# Altium project NANOEveryV3.0.PrjPcb
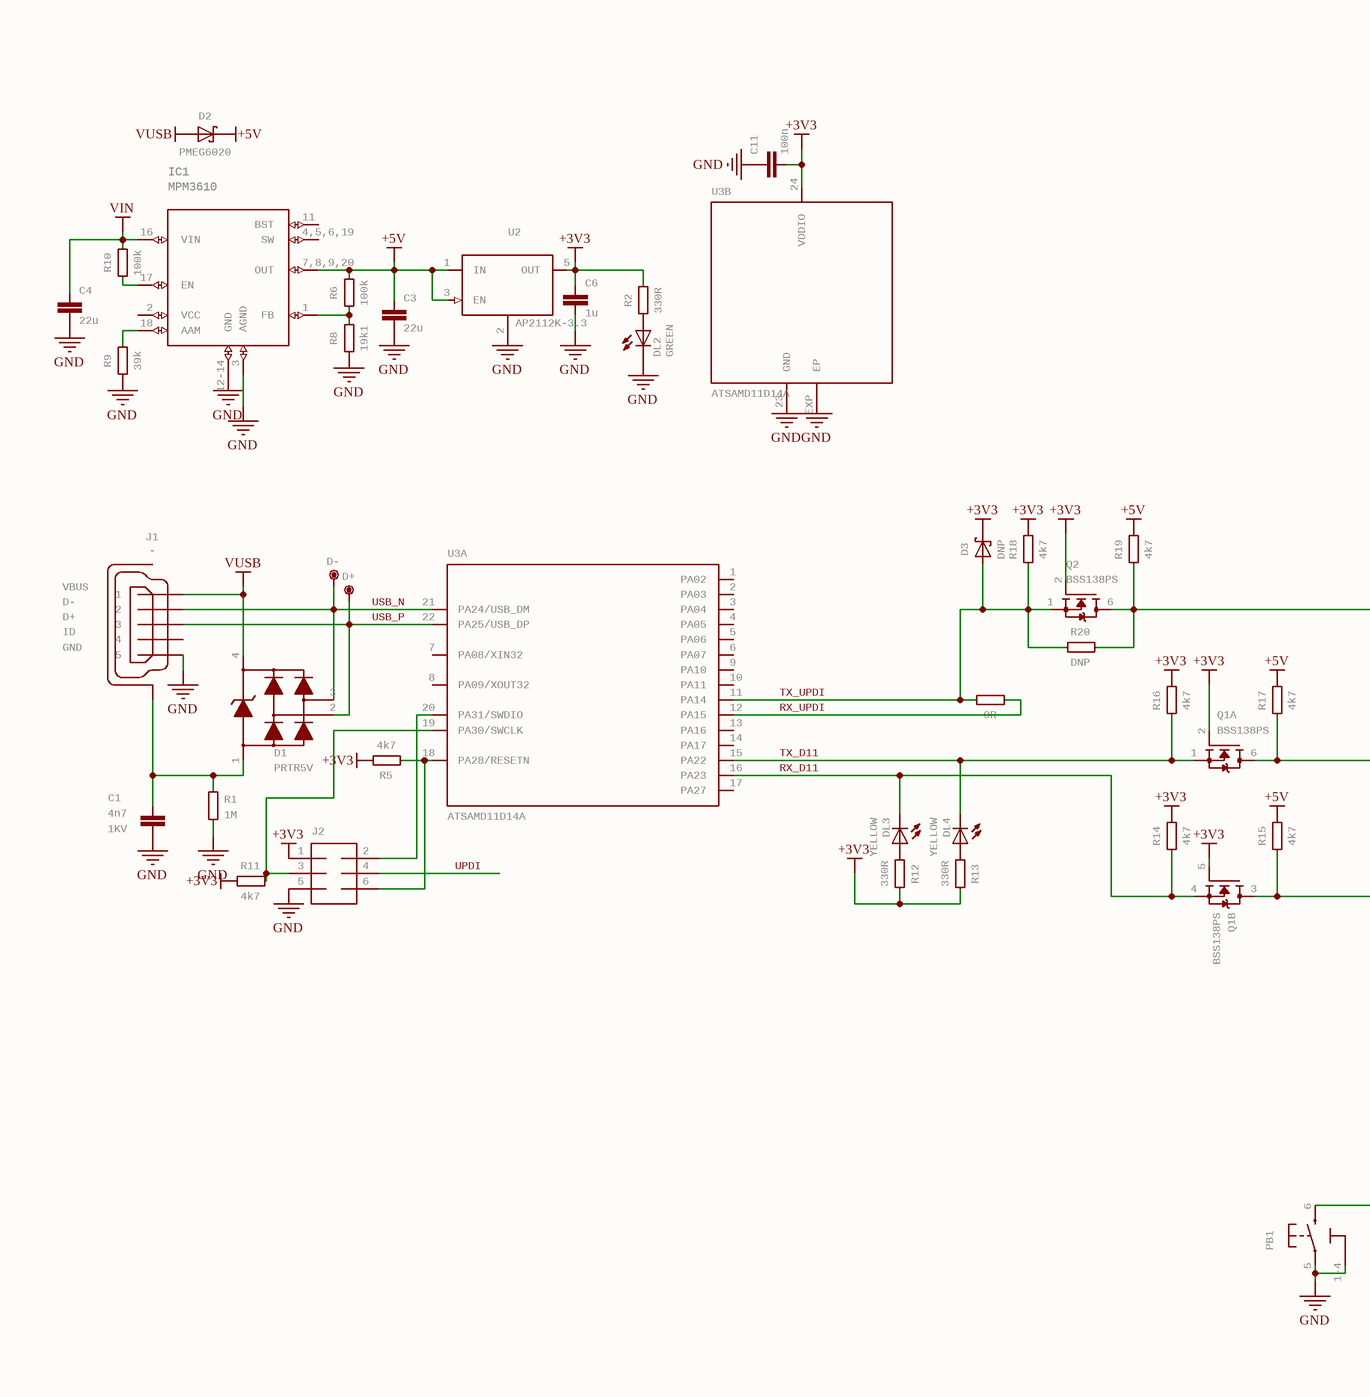
[diagram p0: NANOEveryV3.0.SchDoc, left]
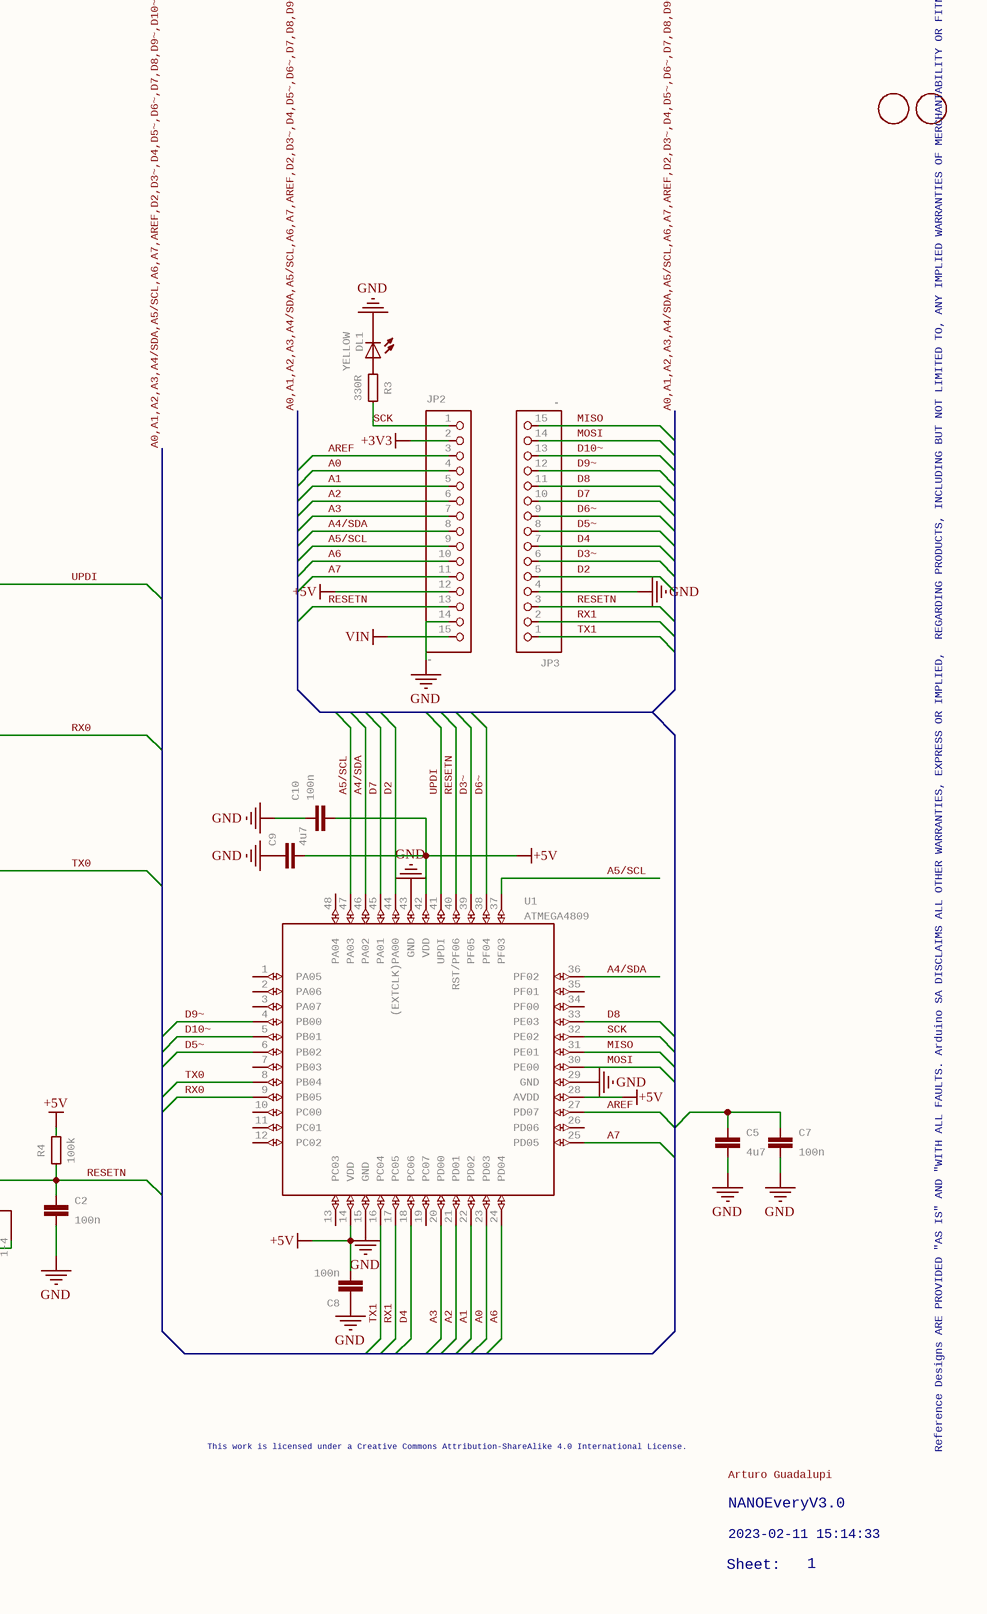
[diagram p1: NANOEveryV3.0.SchDoc, right]
1 sheet, 53 parts. Net scope: global (net labels, ports and power ports of the same name join across sheets).
Board file: NANOEveryV3.0.PcbDoc

## Sheet NANOEveryV3.0.SchDoc: NANOEveryV3.0
size 411 x 291 mm; Origin: Eagle; Date: 2023-02-11 15:14:33; SheetNumber: 1; CODE-ARDUINO: DNP; DATASHEET: DNP; DISTRIBUTOR-LINK: DNP; DISTRIBUTOR-PN: DNP; MANUFACTURER: DNP; MANUFACTURER-PN: DNP; NOTE: DNP; Value: DNP; GateName_1: G$1; SymbolName_1: A3L-LOC; LibraryName: Arduino-utility; DeviceSetName: A3-FRAME; Sheet: Sheet:; ReferenceDesignsAREPROVIDED"ASIS"AND"WITHALLFAULTS.ArduinoSADISCLAIMSALLOTHERWARRANTIES,EXPRESSORIMPLIED,
REGARDINGPRODUCTS,INCLUDINGBUTNOTLIMITEDTO,ANYIMPLIEDWARRANTIESOFMERCHANTABILITYORFITNESSFORAPARTICULARPURPOSE

ArduinoSAmaymakechangestospecificationsandproductdescriptionsatanytime,withoutnotice.TheCustomermustnot
relyontheabsenceorcharacteristicsofanyfeaturesorinstructionsmarked"reserved"or"undefined."ArduinoSAreserves
theseforfuturedefinitionandshallhavenoresponsibilitywhatsoeverforconflictsorincompatibilitiesarisingfromfuturechangestothem.
TheproductinformationontheWebSiteorMaterialsissubjecttochangewithoutnotice.Donotfinalizeadesignwiththisinfo

ARDUINOandotherArduinobrandsandlogosandTrademarksofArduinoSA.AllArduinoSATrademarkscannotbeusedwithoutowner'sformalpermission: Reference Designs ARE PROVIDED "AS IS" AND "WITH ALL FAULTS. Arduino SA DISCLAIMS ALL OTHER WARRANTIES, EXPRESS OR IMPLIED, / REGARDING PRODUCTS, INCLUDING BUT NOT LIMITED TO, ANY IMPLIED WARRANTIES OF MERCHANTABILITY OR FITNESS FOR A PARTICULAR PURPOSE / Arduino SA may make changes to specifications and product descriptions at any time, without notice. The Customer must not / rely on the absence or characteristics of any features or instructions marked "reserved" or "undefined." Arduino SA reserves / these for future definition and shall have no responsibility whatsoever for conflicts or incompatibilities arising from future changes to them. / The product information on the Web Site or Materials is subject to change without notice. Do not finalize a design with this info / ARDUINO and other Arduino brands and logos and Trademarks of Arduino SA. All Arduino SA Trademarks cannot be used without owner's formal permission; ThisworkislicensedunderaCreativeCommonsAttribution-ShareAlike4.0InternationalLicense.: This work is licensed under a Creative Commons Attribution-ShareAlike 4.0 International License.

### Parts
C1  4n7  VOLTAGE: 1KV  [0805-R2013X50N]
C2  100n  [0402-1005X55N]
C3  22u  [0805-R2013X50N]
C4  22u  [0805-R2013X50N]
C5  4u7  [0402-1005X55N]
C6  1u  [0402-1005X55N]
C7  100n  [0402-1005X55N]
C8  100n  [0402-1005X55N]
C9  4u7  [0402-1005X55N]
C10  100n  [0402-1005X55N]
C11  100n  [0402-1005X55N]
D1  PRTR5V  [SOT190P230X110-4N]
D2  PMEG6020  [SODFL3517X110N]
D3  DNP  [SODFL3517X110N]
D+  DNP  [TP-1.00MM]  (value not drawn)
D-  DNP  [TP-1.00MM]  (value not drawn)
DL1  YELLOW  [LEDC1608X80N-AK]
DL2  GREEN  [LEDC1608X80N-AK]
DL3  YELLOW  [LEDC1608X80N-AK]
DL4  YELLOW  [LEDC1608X80N-AK]
FD1  DNP  [FD-1-1.5]  (value not drawn)
FD2  DNP  [FD-1-1.5]  (value not drawn)
IC1  MPM3610  [MPM3610]
J1  -  [ZX62-AB-5PA]
J2  DNP  [2X03-TP]  (value not drawn)
JP2  -  [1X15-CASTELL]
JP3  -  [1X15-CASTELL]
PB1  PTS820  [C&K_PTS820_NO_HOLES]  (value not drawn)
Q1  BSS138PS  [SOT363]  (parts A,B of 2)
Q2  BSS138PS  [SOT363]
R1  1M  [0402-1005X55N]
R2  330R  [0402-1005X55N]
R3  330R  [0402-1005X55N]
R4  100k  [0402-1005X55N]
R5  4k7  [0402-1005X55N]
R6  100k  [0402-1005X55N]
R7  0R  [0402-1005X55N]
R8  19k1  [0402-1005X55N]
R9  39k  [0402-1005X55N]
R10  100k  [0402-1005X55N]
R11  4k7  [0402-1005X55N]
R12  330R  [0402-1005X55N]
R13  330R  [0402-1005X55N]
R14  4k7  [0402-1005X55N]
R15  4k7  [0402-1005X55N]
R16  4k7  [0402-1005X55N]
R17  4k7  [0402-1005X55N]
R18  4k7  [0402-1005X55N]
R19  4k7  [0402-1005X55N]
R20  DNP  [0402-1005X55N]
U1  ATMEGA4809  [TQFP48]
U2  AP2112K-3.3  [SOT25]
U3  ATSAMD11D14A  [HVQFN24]  (parts A,B of 2)

### Nets
+3V3: C6.1 C11.2 D3.C J2.1 JP2.2 Q1.2(G) Q1.5(G) Q2.2(G) R2.2 R5.2 R11.1 R12.2 R13.2 R14.2 R16.2 R18.2 U2.5(OUT) U3.24(VDDIO)
+5V: C3.1 C8.2 C9.2 C10.2 D2.C IC1.7,8,9,20(OUT) JP2.12 R4.2 R6.2 R15.2 R17.2 R19.2 U1.14(VDD) U1.28(AVDD) U1.42(VDD) U2.1(IN) U2.3(EN)
GND: C1.2 C2.2 C3.2 C4.2 C5.2 C6.2 C7.2 C8.1 C9.1 C10.1 C11.1 DL1.C DL2.C IC1.3(AGND) IC1.12-14(GND) J1.5 J2.5 JP2.14 JP3.4 PB1.1-4 PB1.5 R1.1 R8.1 R9.1 U1.15(GND) U1.29(GND) U1.43(GND) U2.2(GND/ADJ) U3.23(GND) U3.EXP(EP)
VIN: C4.1 IC1.16(VIN) JP2.15 R10.2
VUSB: D1.4 D2.A J1.1
A0: JP2.4 U1.23(PD03)
A1: JP2.5 U1.22(PD02)
A2: JP2.6 U1.21(PD01)
A3: JP2.7 U1.20(PD00)
A4/SDA: JP2.8 U1.36(PF02) U1.46(PA02)
A5/SCL: JP2.9 U1.37(PF03) U1.47(PA03)
A6: JP2.10 U1.24(PD04)
A7: JP2.11 U1.25(PD05)
AREF: C5.1 C7.1 JP2.3 U1.27(PD07)
D2: JP3.5 U1.44((EXTCLK)PA00)
D3~: JP3.6 U1.39(PF05)
D4: JP3.7 U1.18(PC06)
D5~: JP3.8 U1.6(PB02)
D6~: JP3.9 U1.38(PF04)
D7: JP3.10 U1.45(PA01)
D8: JP3.11 U1.33(PE03)
D9~: JP3.12 U1.4(PB00)
D10~: JP3.13 U1.5(PB01)
MISO: JP3.15 U1.31(PE01)
MOSI: JP3.14 U1.30(PE00)
RESETN: C2.1 JP2.13 JP3.3 PB1.6 R4.1 U1.40(RST/PF06)
RX0: Q1.6(D) R17.1 U1.9(PB05)
RX1: JP3.2 U1.17(PC05)
RX_D11: DL3.C Q1.4(S) R14.1 U3.16(PA23)
RX_UPDI: R7.2 U3.12(PA15)
SCK: JP2.1 R3.2 U1.32(PE02)
TX0: Q1.3(D) R15.1 U1.8(PB04)
TX1: JP3.1 U1.16(PC04)
TX_D11: DL4.C Q1.1(S) R16.1 U3.15(PA22)
TX_UPDI: D3.A Q2.1(S) R7.1 R18.1 R20.1 U3.11(PA14)
UPDI: J2.4 Q2.6(D) R19.1 R20.2 U1.41(UPDI)
USB_N: D1.3 D-.X(P$1) J1.2 U3.21(PA24/USB_DM)
USB_P: D1.2 D+.X(P$1) J1.3 U3.22(PA25/USB_DP)
NetC1_1: C1.1 D1.1 J1.6-11(SH) R1.2
NetDL1_A: DL1.A R3.1
NetDL2_A: DL2.A R2.1
NetDL3_A: DL3.A R12.1
NetDL4_A: DL4.A R13.1
NetIC1_1: IC1.1(FB) R6.1 R8.2
NetIC1_17: IC1.17(EN) R10.1
NetIC1_18: IC1.18(AAM) R9.2
NetJ2_2: J2.2 U3.20(PA31/SWDIO)
NetJ2_3: J2.3 R11.2 U3.19(PA30/SWCLK)
NetJ2_6: J2.6 R5.1 U3.18(PA28/RESETN)

Not connected (* = marked no-connect by the designer): IC1 2(VCC) 4,5,6,19(SW) 11(BST); J1 4; U1 1(PA05) 2(PA06) 3(PA07) 7(PB03) 10(PC00) 11(PC01) 12(PC02) 13(PC03) 19(PC07) 26(PD06) 34(PF00) 35(PF01) 48(PA04); U3 1(PA02) 2(PA03) 3(PA04) 4(PA05) 5(PA06) 6(PA07) 7(PA08/XIN32) 8(PA09/XOUT32) 9(PA10) 10(PA11) 13(PA16) 14(PA17) 17(PA27)

### Buses and harness runs
bus A0,A1,A2,A3,A4/SDA,A5/SCL,A6,A7,AREF,D2,D3~,D4,D5~,D6~,D7,D8,D9~,D10~,MISO,MOSI,RESETN,RX0,RX1,SCK,TX1,UPDI,VIN

### Notes on the sheet
- This work is licensed under a Creative Commons Attribution-ShareAlike 4.0 International License.
- (near FD2) Reference Designs ARE PROVIDED "AS IS" AND "WITH ALL FAULTS. Arduino SA DISCLAIMS ALL OTHER WARRANTIES, EXPRESS OR IMPLIED,
  REGARDING PRODUCTS, INCLUDING BUT NOT LIMITED TO, ANY IMPLIED WARRANTIES OF MERCHANTABILITY OR FITNESS FOR A PARTICULAR PURPOSE
  Arduino SA may make changes to specifications and product descriptions at any time, without notice. The Customer must not
  rely on the absence or characteristics of any features or instructions marked "reserved" or "undefined." Arduino SA reserves
  these for future definition and shall have no responsibility whatsoever for conflicts or incompatibilities arising from future changes to them.
  The product information on the Web Site or Materials is subject to change without notice. Do not finalize a design with this info
  ARDUINO and other Arduino brands and logos and Trademarks of Arduino SA. All Arduino SA Trademarks cannot be used without owner's formal permission
- Arturo Guadalupi
- NANOEveryV3.0
- Sheet:
- 2023-02-11 15:14:33
- 1

### Library data of the parts
C1 = C-0805: SMD Capacitor; MANUFACTURER: Kemet; MANUFACTURER-PN: C0805C472KDRACTU; GateName_1: G$1; SymbolName_1: C; DeviceName: -0805; CODE-ARDUINO: 0689; LibraryName: Arduino-rcl; DeviceSetName: C; DATASHEET: http://www.kemet.com/Lists/ProductCatalog/Attachments/40/KEM_C1010_X7R_HV_SMD.pdf; DISTRIBUTOR-LINK: www.kemet.com/docfinder?Partnumber=C0805C472KDRACTU; DISTRIBUTOR-PN: 399-6738-1-ND; NOTE: -
C2 C7 C8 C10 C11 = C-0402: SMD Capacitor; MANUFACTURER: TDK; MANUFACTURER-PN: C1005X5R1H104K050BB; GateName_1: G$1; SymbolName_1: C; DeviceName: -0402; CODE-ARDUINO: 0132; LibraryName: Arduino-rcl; DeviceSetName: C; DATASHEET: http://www.tdk.com/pdf/TDKMLCCCapRange.pdf; DISTRIBUTOR-LINK: http://www.digikey.com/product-detail/en/tdk-corporation/C1005X5R1H104K050BB/445-5942-1-ND/2443982; DISTRIBUTOR-PN: 445-5942-1-ND; NOTE: -
C3 C4 = C-0805: SMD Capacitor; MANUFACTURER: Samsung; MANUFACTURER-PN: CL21A226MQCLQNC; GateName_1: G$1; SymbolName_1: C; DeviceName: -0805; CODE-ARDUINO: 2233; LibraryName: Arduino-rcl; DeviceSetName: C; DATASHEET: https://media.digikey.com/pdf/Data%20Sheets/Samsung%20PDFs/CL21A226MQCLQNC_character.pdf; DISTRIBUTOR-LINK: https://www.digikey.com/product-detail/en/samsung-electro-mechanics-america-inc/CL21A226MQCLQNC/1276-2412-1-ND/3890498; DISTRIBUTOR-PN: 1276-2412-1-ND; NOTE: -
C5 C9 = C-0402: SMD Capacitor; MANUFACTURER: Murata; MANUFACTURER-PN: GRM155R60J475ME47D; GateName_1: G$1; SymbolName_1: C; DeviceName: -0402; CODE-ARDUINO: 0833; LibraryName: Arduino-rcl; DeviceSetName: C; DATASHEET: http://search.murata.co.jp/Ceramy/image/img/A01X/partnumbering_e_01.pdf; DISTRIBUTOR-LINK: http://www.digikey.com/product-detail/en/murata-electronics-north-america/GRM155R60J475ME47D/490-5915-1-ND/3719860; DISTRIBUTOR-PN: 490-5915-1-ND; NOTE: -
C6 = C-0402: SMD Capacitor; MANUFACTURER: Murata; MANUFACTURER-PN: GRM155R61E105KA12D; GateName_1: G$1; SymbolName_1: C; DeviceName: -0402; CODE-ARDUINO: 0133; LibraryName: Arduino-rcl; DeviceSetName: C; DATASHEET: http://search.murata.co.jp/Ceramy/image/img/A01X/partnumbering_e_01.pdf; DISTRIBUTOR-LINK: http://www.digikey.com/product-detail/en/murata-electronics-north-america/GRM155R61E105KA12D/490-10017-1-ND/5026367; DISTRIBUTOR-PN: 490-10017-1-ND; NOTE: -
D1 = PRTR5V0U2X,215: USB ESD protection; MANUFACTURER: NXP; GateName_1: G$1; CODE-ARDUINO: 2209; SymbolName_1: PRTR5V0U2X; LibraryName: Arduino-diodes; DeviceSetName: PRTR5V0U2X,215; DATASHEET: http://www.nxp.com/documents/data_sheet/PRTR5V0U2X.pdf; DISTRIBUTOR-LINK: http://www.digikey.com/product-detail/en/nxp-semiconductors/PRTR5V0U2X,215/568-4140-1-ND/1589981; DISTRIBUTOR-PN: 568-4140-1-ND; MANUFACTURER-PN: PRTR5V0U2X,215
D2 = PMEG6020AELRX: 60 V, 2 A low leakage current Schottky barrier rectifier   Datasheet; MANUFACTURER: NXP; GateName_1: G$1; SymbolName_1: SCHOTTKY-2; CODE-ARDUINO: 2208 or 0025; LibraryName: Arduino-diodes; DeviceSetName: PMEG6020AELRX; DATASHEET: http://www.nxp.com/documents/data_sheet/PMEG6020AELR.pdf; DISTRIBUTOR-LINK: http://www.digikey.com/products/en?keywords=%20568-12710-1-ND; DISTRIBUTOR-PN: 568-12710-1-ND; MANUFACTURER-PN: PMEG6020AELRX
D3 = PMEG6020AELRX: 60 V, 2 A low leakage current Schottky barrier rectifier   Datasheet; GateName_1: G$1; SymbolName_1: SCHOTTKY-2; LibraryName: Arduino-diodes; DeviceSetName: PMEG6020AELRX; CODE-ARDUINO: DNP; DATASHEET: DNP; DISTRIBUTOR-LINK: DNP; DISTRIBUTOR-PN: DNP; MANUFACTURER: DNP; MANUFACTURER-PN: DNP
D+ D- = TPTP-1.00MM: Testpoint; GateName_1: G$1; DeviceSetName: TP; SymbolName_1: TESTPOINT; DeviceName: TP-1.00MM; LibraryName: Arduino-utility; CODE-ARDUINO: DNP; DATASHEET: DNP; DISTRIBUTOR-LINK: DNP; DISTRIBUTOR-PN: DNP; MANUFACTURER: DNP; MANUFACTURER-PN: DNP
DL1 DL3 DL4 = LED-0603: LED; MANUFACTURER: Avago; MANUFACTURER-PN: HSMY-C190; GateName_1: G$1; DeviceName: -0603; CODE-ARDUINO: 2243; SymbolName_1: LED; LibraryName: Arduino-diodes; DeviceSetName: LED; DATASHEET: http://media.digikey.com/pdf/Data%20Sheets/Avago%20PDFs/HSMz-Czzz.pdf; DISTRIBUTOR-LINK: http://www.digikey.com/product-detail/en/broadcom-limited/HSMY-C190/516-1424-1-ND/637748; DISTRIBUTOR-PN: 516-1424-1-ND
DL2 = LED-0603: LED; MANUFACTURER: Avago; MANUFACTURER-PN: HSMG-C190; GateName_1: G$1; DeviceName: -0603; CODE-ARDUINO: 2204; SymbolName_1: LED; LibraryName: Arduino-diodes; DeviceSetName: LED; DATASHEET: http://media.digikey.com/pdf/Data%20Sheets/Avago%20PDFs/HSMz-Czzz.pdf; DISTRIBUTOR-LINK: http://www.digikey.com/product-detail/en/broadcom-limited/HSMG-C190/516-1425-1-ND/637749; DISTRIBUTOR-PN: 516-1425-1-ND
FD1 FD2 = FIDUCIAL-1.5MM: Fiducial mount; GateName_1: G$1; SymbolName_1: ARDUINO_FIDUCIAL; DeviceName: -1.5MM; LibraryName: Arduino-utility; DeviceSetName: FIDUCIAL; CODE-ARDUINO: DNP; DATASHEET: DNP; DISTRIBUTOR-LINK: DNP; DISTRIBUTOR-PN: DNP; MANUFACTURER: DNP; MANUFACTURER-PN: DNP
IC1 = MPM3610: MPM3610 Step Down Regulator; MANUFACTURER: MPS; MANUFACTURER-PN: MPM3610AGQV-P; GateName_1: G$1; CODE-ARDUINO: 2093; RESTRICTIONS: NO; SymbolName_1: MPM3610; LibraryName: Arduino-ICs; DeviceSetName: MPM3610; DATASHEET: https://www.monolithicpower.com/pub/media/document/MPM3610_r1.01.pdf; DISTRIBUTOR-LINK: https://www.digikey.com/product-detail/en/monolithic-power-systems-inc/MPM3610AGQV-P/1589-1249-1-ND/5298336; DISTRIBUTOR-PN: 1589-1249-1-ND
J1 = USB-MICRO: USB - micro AB USB 2.0 Receptacle Connector 5 Position Surface Mount, Right Angle, Horizontal; MANUFACTURER: Hirose; MANUFACTURER-PN: ZX62-AB-5PA(31); GateName_1: G$1; CODE-ARDUINO: 2219; SymbolName_1: USB-MICRO; LibraryName: Arduino-connectors; DeviceSetName: USB-MICRO; VBUS: VBUS; D-: D-; D+: D+; ID: ID; GND: GND; DATASHEET: https://www.hirose.com/product/en/download_file/key_name/ZX/category/Catalog/doc_file_id/31704/?file_category_id=4&item_id=13&is_series=1; DISTRIBUTOR-LINK: http://www.digikey.com/product-detail/en/hirose-electric-co-ltd/ZX62-AB-5PA(31)/H125279CT-ND/5994741; DISTRIBUTOR-PN: H125279CT-ND
J2 = PINHD-2X03-SMTP: PIN HEADER; GateName_1: G$1; SymbolName_1: 3X02; DeviceName: TP; LibraryName: Arduino-connectors; DeviceSetName: PINHD-2X03-SM; CODE-ARDUINO: DNP; DATASHEET: DNP; DISTRIBUTOR-LINK: DNP; DISTRIBUTOR-PN: DNP; MANUFACTURER: DNP; MANUFACTURER-PN: DNP; NOTE: DNP
JP2 JP3 = PINHD-1X15-CASTELLATED: PIN HEADER; GateName_1: A; SymbolName_1: ARDUINO-CONNECTORS_PINHD15; CODE-ARDUINO: 0646; NOTE: DNM; DeviceName: -CASTELLATED; LibraryName: Arduino-connectors; DeviceSetName: PINHD-1X15; DATASHEET: -; DISTRIBUTOR-LINK: -; DISTRIBUTOR-PN: -; MANUFACTURER: -; MANUFACTURER-PN: -
PB1 = TACTILE1PTS820-NH: Tactile Switch SPST-NO Top Actuated Surface Mount; MANUFACTURER: C&K; MANUFACTURER-PN: PTS820 J25K SMTR LFS; GateName_1: G$1; SymbolName_1: TACTILE-3PINS; CODE-ARDUINO: 0173; DeviceName: PTS820-NH; LibraryName: Arduino-pushbuttons; DeviceSetName: TACTILE1; DATASHEET: http://www.ckswitches.com/media/1474/pts820.pdf; DISTRIBUTOR-LINK: https://www.digikey.com/product-detail/en/c-k/PTS820-J15M-SMTR-LFS/CKN10506CT-ND/4176681; DISTRIBUTOR-PN: PTS820 J25K SMTR LFS-ND
Q1 = BSS138PS: MOSFET 2N-CH 60V 0.32A 6TSSOP; MANUFACTURER: DNP; GateName_1: -1; SymbolName_1: MOSFET_N-CHN; GateName_2: -2; SymbolName_2: MOSFET_N-CHN; LibraryName: Arduino-transistors; DeviceSetName: BSS138PS; CODE-ARDUINO: CODE-ARDUINO; DATASHEET: DNP; DISTRIBUTOR-LINK: DNP; DISTRIBUTOR-PN: DNP; MANUFACTURER-PN: DNP
Q2 = BSS138PS: MOSFET 2N-CH 60V 0.32A 6TSSOP; MANUFACTURER: DNP; GateName_1: -1; SymbolName_1: MOSFET_N-CHN; LibraryName: Arduino-transistors; DeviceSetName: BSS138PS; CODE-ARDUINO: CODE-ARDUINO; DATASHEET: DNP; DISTRIBUTOR-LINK: DNP; DISTRIBUTOR-PN: DNP; MANUFACTURER-PN: DNP
R1 = R-0402: SMD Resistor; MANUFACTURER: Yageo; MANUFACTURER-PN: RC0402JR-07330RL; GateName_1: G$1; SymbolName_1: R; DeviceName: -0402; CODE-ARDUINO: 0139; NOTE: NO; LibraryName: Arduino-rcl; DeviceSetName: R; DATASHEET: www.yageo.com.tw/exep/pages/download/literatures/PYu-R_INT-thick_7.pdf; DISTRIBUTOR-LINK: http://www.digikey.com/product-detail/en/yageo/RC0402JR-07330RL/311-330JRCT-ND/729412; DISTRIBUTOR-PN: 311-330JRCT-ND
R2 R3 R12 R13 = R-0402: SMD Resistor; MANUFACTURER: Yageo; MANUFACTURER-PN: RC0402FR-07330RL; GateName_1: G$1; SymbolName_1: R; DeviceName: -0402; CODE-ARDUINO: 2229; NOTE: NO; LibraryName: Arduino-rcl; DeviceSetName: R; DATASHEET: www.yageo.com.tw/exep/pages/download/literatures/PYu-R_INT-thick_7.pdf; DISTRIBUTOR-LINK: http://www.digikey.com/product-detail/en/yageo/RC0402FR-07330RL/311-330LRCT-ND/729541; DISTRIBUTOR-PN: 311-330LRCT-ND
R4 R6 R10 = R-0402: SMD Resistor; MANUFACTURER: Yageo; MANUFACTURER-PN: RC0402FR-07100KL; GateName_1: G$1; SymbolName_1: R; DeviceName: -0402; CODE-ARDUINO: 0134; NOTE: NO; LibraryName: Arduino-rcl; DeviceSetName: R; DATASHEET: www.yageo.com.tw/exep/pages/download/literatures/PYu-R_INT-thick_7.pdf; DISTRIBUTOR-LINK: http://www.digikey.com/product-detail/en/yageo/RC0402FR-07100KL/311-100KLRCT-ND/729473; DISTRIBUTOR-PN: 311-100KLRCT-ND
R5 R11 R14-R19 = R-0402: SMD Resistor; MANUFACTURER: Yageo; MANUFACTURER-PN: RC0402FR-074K7L; GateName_1: G$1; SymbolName_1: R; DeviceName: -0402; CODE-ARDUINO: 2196; NOTE: NO; LibraryName: Arduino-rcl; DeviceSetName: R; DATASHEET: www.yageo.com.tw/exep/pages/download/literatures/PYu-R_INT-thick_7.pdf; DISTRIBUTOR-LINK: http://www.digikey.com/product-detail/en/yageo/RC0402FR-074K7L/311-4.7KLRCT-ND/2827881; DISTRIBUTOR-PN: 311-4.7KLRCT-ND
R7 = R-0402: SMD Resistor; MANUFACTURER: Yageo; MANUFACTURER-PN: RC0402FR-070RL; GateName_1: G$1; SymbolName_1: R; DeviceName: -0402; CODE-ARDUINO: 0039; NOTE: NO; LibraryName: Arduino-rcl; DeviceSetName: R; DATASHEET: www.yageo.com.tw/exep/pages/download/literatures/PYu-R_INT-thick_7.pdf; DISTRIBUTOR-LINK: http://www.digikey.com/product-detail/en/yageo/RC0402FR-070RL/311-0.0LRCT-ND/2827888; DISTRIBUTOR-PN: 311-0.0LRCT-ND
R8 = R-0402: SMD Resistor; MANUFACTURER: Yageo; MANUFACTURER-PN: RC0402FR-0719K1L; GateName_1: G$1; SymbolName_1: R; DeviceName: -0402; CODE-ARDUINO: A5369; NOTE: NO; LibraryName: Arduino-rcl; DeviceSetName: R; DATASHEET: http://www.yageo.com/documents/recent/PYu-RC_Group_51_RoHS_L_10.pdf; DISTRIBUTOR-LINK: https://www.digikey.it/product-detail/it/yageo/RC0402FR-0719K1L/311-19.1KLRTR-ND/726552; DISTRIBUTOR-PN: 311-19.1KLRTR-ND
R9 = R-0402: SMD Resistor; MANUFACTURER: Yageo; MANUFACTURER-PN: RC0402JR-0739KL; GateName_1: G$1; SymbolName_1: R; DeviceName: -0402; CODE-ARDUINO: A5479; NOTE: NO; LibraryName: Arduino-rcl; DeviceSetName: R; DATASHEET: www.yageo.com.tw/exep/pages/download/literatures/PYu-R_INT-thick_7.pdf; DISTRIBUTOR-LINK: https://www.digikey.com/product-detail/en/yageo/RC0402JR-0739KL/311-39KJRCT-ND/729420; DISTRIBUTOR-PN: 311-39KJRCT-ND
R20 = R-0402: SMD Resistor; GateName_1: G$1; SymbolName_1: R; DeviceName: -0402; NOTE: NO; LibraryName: Arduino-rcl; DeviceSetName: R; CODE-ARDUINO: DNP; DATASHEET: DNP; DISTRIBUTOR-LINK: DNP; DISTRIBUTOR-PN: DNP; MANUFACTURER: DNP; MANUFACTURER-PN: DNP
U1 = ATMEGA4809: MANUFACTURER: Microchip; MANUFACTURER-PN: ATMEGA4809-AFR; GateName_1: G$1; SymbolName_1: ATMEGA4809; LibraryName: Arduino-ucs&SoCs; DeviceSetName: ATMEGA4809; CODE-ARDUINO: ATMEGA4809; DATASHEET: http://ww1.microchip.com/downloads/en/DeviceDoc/40002016A.pdf; DISTRIBUTOR-LINK: https://www.digikey.com/product-detail/en/microchip-technology/ATMEGA4809-AFR/ATMEGA4809-AFRCT-ND/8540756; DISTRIBUTOR-PN: ATMEGA4809-AFRCT-ND
U2 = AP2112K-3.3: IC REG LINEAR 3.3V 600mA SOT25; GateName_1: G$1; SymbolName_1: LINEAR_EN; CODE-ARDUINO: DNP; LibraryName: Arduino-ICs; DeviceSetName: AP2112K-3.3; DATASHEET: DNP; DISTRIBUTOR-LINK: DNP; DISTRIBUTOR-PN: DNP; MANUFACTURER: DNP; MANUFACTURER-PN: DNP; NOTE: DNP
U3 = ATSAMD11D14: IC MCU 32BIT 16KB FLASH 24QFN; MANUFACTURER: Microchip; MANUFACTURER-PN: ATSAMD11D14A-MUT; GateName_1: A; SymbolName_1: ATSAMD11-24-A; GateName_2: B; SymbolName_2: ATSAMD11-24-B; CODE-ARDUINO: ATSAM-D11-D14A-MUT; LibraryName: Arduino-ucs&SoCs; DeviceSetName: ATSAMD11D14; DATASHEET: http://ww1.microchip.com/downloads/en/DeviceDoc/Atmel-42363-SAM-D11_Datasheet.pdf; DISTRIBUTOR-LINK: https://www.digikey.com/product-detail/it/microchip-technology/ATSAMD11D14A-MUT/ATSAMD11D14A-MUTCT-ND/5226480; DISTRIBUTOR-PN: ATSAMD11D14A-MUTCT-ND